# EAGLE design Curious-C (EAGLE 5.11)
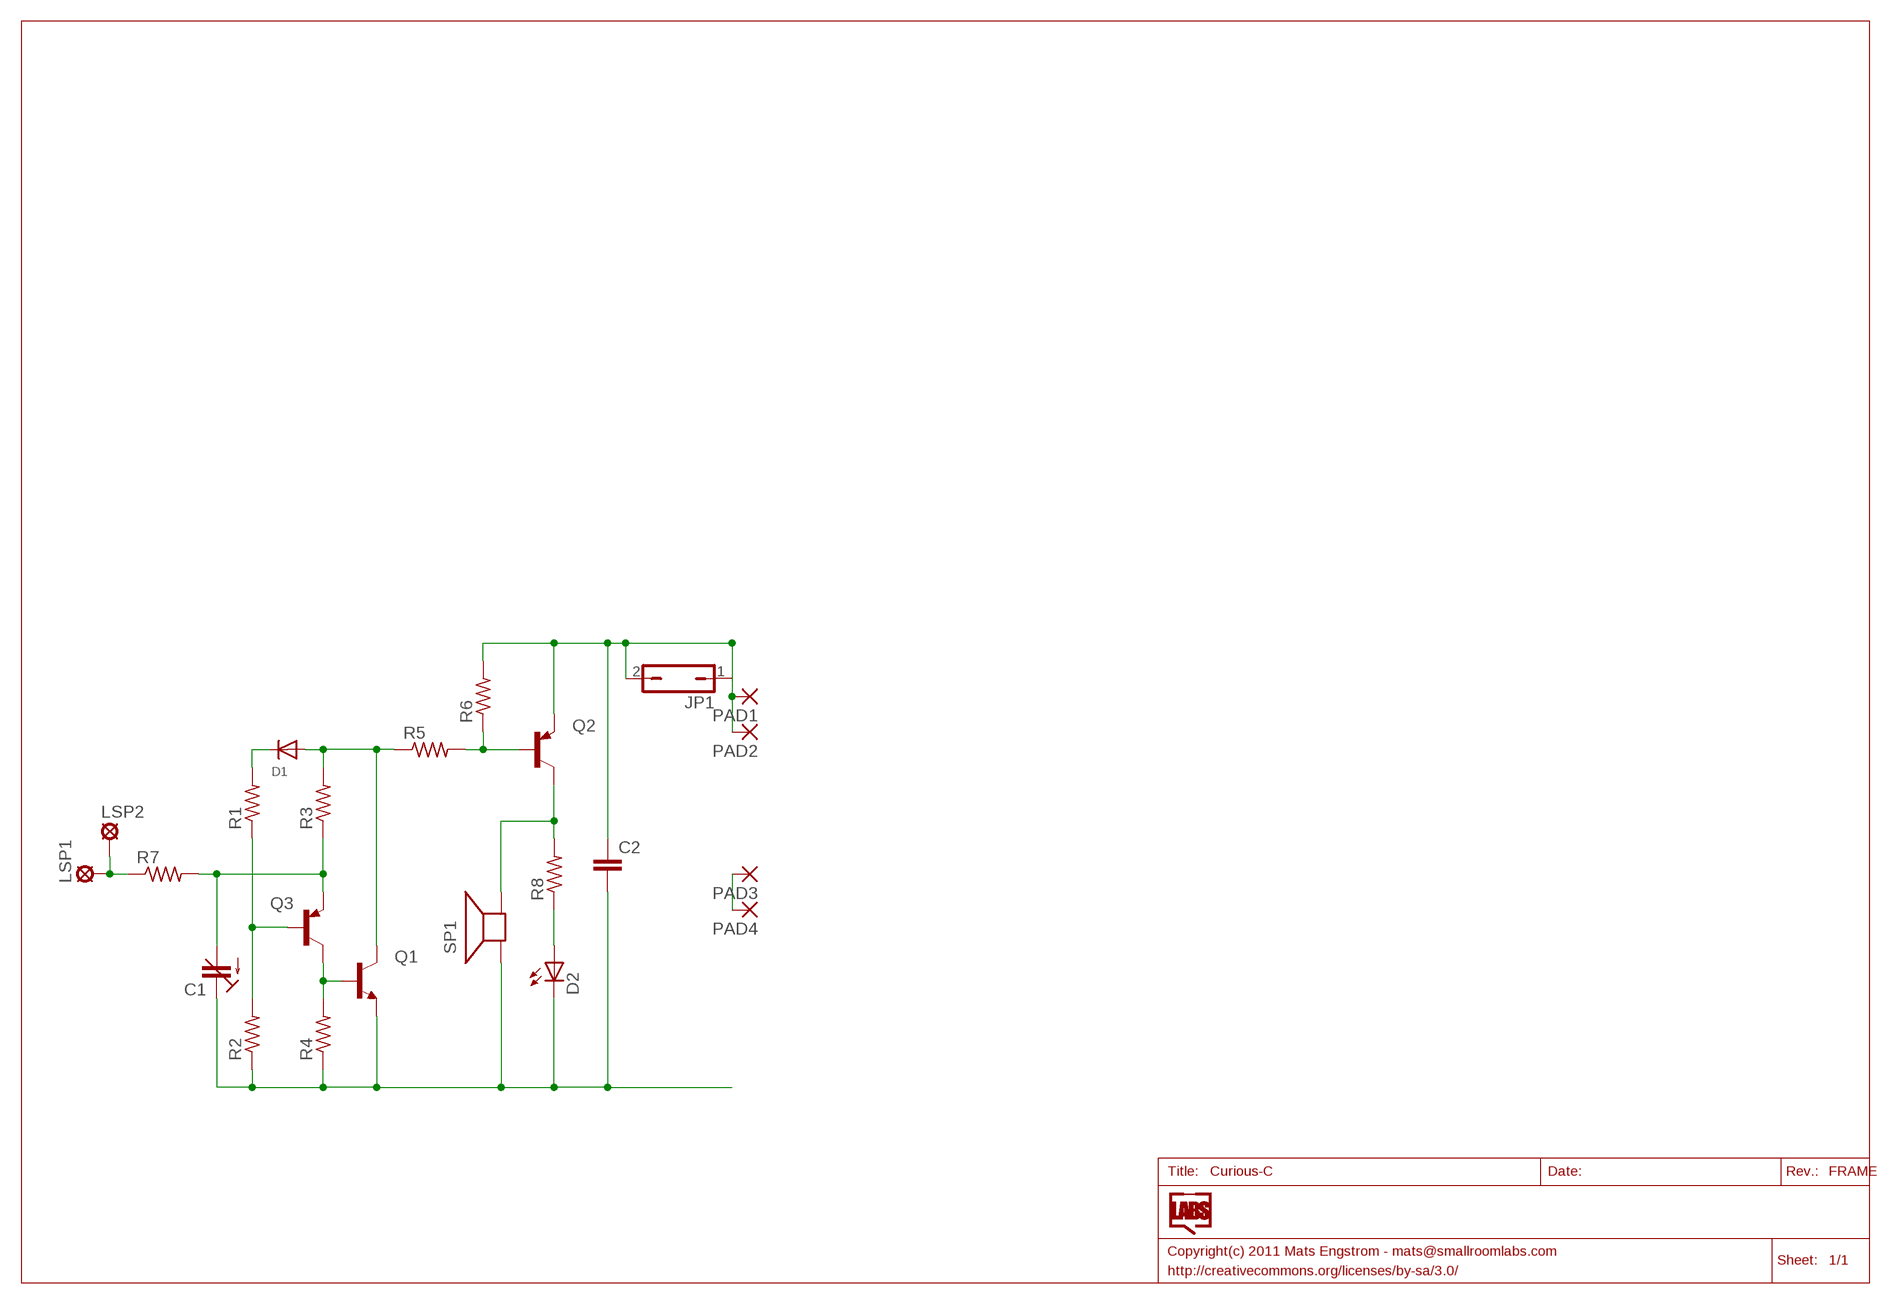
[diagram p0: schematic, sheet 1]

## Parts
C1  C-TRIMM808  [CTRIM808-BC]
C2  C-EU050-025X075  [C050-025X075]
D1  DIODEDO-1N4148  [DO-1N4148]
D2  LED3MM  [LED3MM]
JP1  JP1Q  [JP1]
LSP1  SE13  [SE13]
LSP2  SE13  [SE13]
PAD1  3,17/1,3  [3,17/1,3]
PAD2  3,17/1,3  [3,17/1,3]
PAD3  3,17/1,3  [3,17/1,3]
PAD4  3,17/1,3  [3,17/1,3]
Q1  2N5088  [TO92]
Q2  2N5087  [TO92]
Q3  2N5087  [TO92]
R1  R-US_0207/10  [0207/10]
R2  R-US_0207/10  [0207/10]
R3  R-US_0207/10  [0207/10]
R4  R-US_0207/10  [0207/10]
R5  R-US_0207/10  [0207/10]
R6  R-US_0207/10  [0207/10]
R7  R-US_0207/10  [0207/10]
R8  R-US_0207/10  [0207/10]
SP1  SPEAKER/PS12  [PS12]

## Nets
GND: C1.1(E) C2.2 D2.K(C) Q1.3(E) R2.1 R4.1 SP1.P$1(+)
MBATT: PAD3.1(P) PAD4.1(P)
N$1: Q1.2(B) Q3.1(C) R4.2
N$2: C1.2(A) Q3.3(E) R3.1 R7.2
N$5: D1.C R1.2
N$6: D1.A Q1.1(C) R3.2 R5.1
N$7: Q3.2(B) R1.1 R2.2
N$9: LSP1.MP LSP2.MP R7.1
N$11: D2.A R8.1
N$12: Q2.1(C) R8.2 SP1.P$2(-)
N$13: Q2.2(B) R5.2 R6.1
VCC: C2.1 JP1.1 JP1.2 PAD1.1(P) PAD2.1(P) Q2.3(E) R6.2

## Library data of the parts
C1 = resistor:C-TRIMM: Trimm capacitor
C2 = rcl:C-EU: CAPACITOR, European symbol
D1 = adafruit:DIODE: Diode SMADIODE - SMA Surface Mount Package 20V 1A Schottky Diode Digikey: 641-1014-6-ND DO-1N4148 - Through Hole Small Current Diode SOD-123 20V 1 A (.5mV Vf) Schottky Diode - Digikey: MBRX120TPMSCT-ND SOD-323 10V 570mA (.38mV Vf, 3ns) Schottky Diode - Digikey: ZLLS410CT-ND SOD-523 30V 30mA Schottky Diode (RB751S-40TE61) - Digikey: RB751S-40TE61CT-ND SOT23-R/W - SOT23 Package (R = Solder Paste/Reflow Ovens, W = Hand-Soldering) BAT54Film 40V 300mA - Digikey: 497-7162-1-ND
D2 = led:LED: LED OSRAM: - CHIPLED LG R971, LG N971, LY N971, LG Q971, LY Q971, LO R971, LY R971 LH N974, LH R974 LS Q976, LO Q976, LY Q976 LO Q996 - Hyper CHIPLED LW Q18S LB Q993, LB Q99A, LB R99A - SideLED LS A670, LO A670, LY A670, LG A670, LP A670 LB A673, LV A673, LT A673, LW A673 LH A674 LY A675 LS A676, LA A676, LO A676, LY A676, LW A676 LS A679, LY A679, LG A679 - Hyper Micro SIDELED® LS Y876, LA Y876, LO Y876, LY Y876 LT Y87S - SmartLED LW L88C, LW L88S LB L89C, LB L89S, LG L890 LS L89K, LO L89K, LY L89K LS L896, LA L896, LO L896, LY L896 - TOPLED LS T670, LO T670, LY T670, LG T670, LP T670 LSG T670, LSP T670, LSY T670, LOP T670, LYG T670 LG T671, LOG T671, LSG T671 LB T673, LV T673, LT T673, LW T673 LH T674 LS T676, LA T676, LO T676, LY T676, LB T676, LH T676, LSB T676, LW T676 LB T67C, LV T67C, LT T67C, LS T67K, LO T67K, LY T67K, LW E67C LS E67B, LA E67B, LO E67B, LY E67B, LB E67C, LV E67C, LT E67C LW T67C LS T679, LY T679, LG T679 LS T770, LO T770, LY T770, LG T770, LP T770 LB T773, LV T773, LT T773, LW T773 LH T774 LS E675, LA E675, LY E675, LS T675 LS T776, LA T776, LO T776, LY T776, LB T776 LHGB T686 LT T68C, LB T68C - Hyper Mini TOPLED® LB M676 - Mini TOPLED Santana® LG M470 LS M47K, LO M47K, LY M47K Source: http://www.osram.convergy.de LUXEON: - LUMILED® LXK2-PW12-R00, LXK2-PW12-S00, LXK2-PW14-U00, LXK2-PW14-V00 LXK2-PM12-R00, LXK2-PM12-S00, LXK2-PM14-U00 LXK2-PE12-Q00, LXK2-PE12-R00, LXK2-PE12-S00, LXK2-PE14-T00, LXK2-PE14-U00 LXK2-PB12-K00, LXK2-PB12-L00, LXK2-PB12-M00, LXK2-PB14-N00, LXK2-PB14-P00, LXK2-PB14-Q00 LXK2-PR12-L00, LXK2-PR12-M00, LXK2-PR14-Q00, LXK2-PR14-R00 LXK2-PD12-Q00, LXK2-PD12-R00, LXK2-PD12-S00 LXK2-PH12-R00, LXK2-PH12-S00 LXK2-PL12-P00, LXK2-PL12-Q00, LXK2-PL12-R00 Source: www.luxeon.com KINGBRIGHT: KA-3528ASYC Source: www.kingbright.com
JP1 = jumper:JP1Q: JUMPER
LSP1 LSP2 = solpad:SE13: SOLDER PAD E1542, drill 1,3mm, distributor Buerklin, 07F815
PAD1-PAD4 = wirepad:3,17/1,3: THROUGH-HOLE PAD
Q1 = transistor:2N5088: NPN TRANSISTOR
Q2 Q3 = transistor-pnp:2N5087: PNP Transistor
R1-R8 = resistor:R-US_: RESISTOR, American symbol
SP1 = adafruit:SPEAKER: SPEAKER Source: Buerklin Added PS12 (for part # PS1240 piezo) http://www.ladyada.net/library/pcb/eaglelibrary.html

## Net classes
0 default: width 0.406 mm, clearance 0.406 mm

## Board
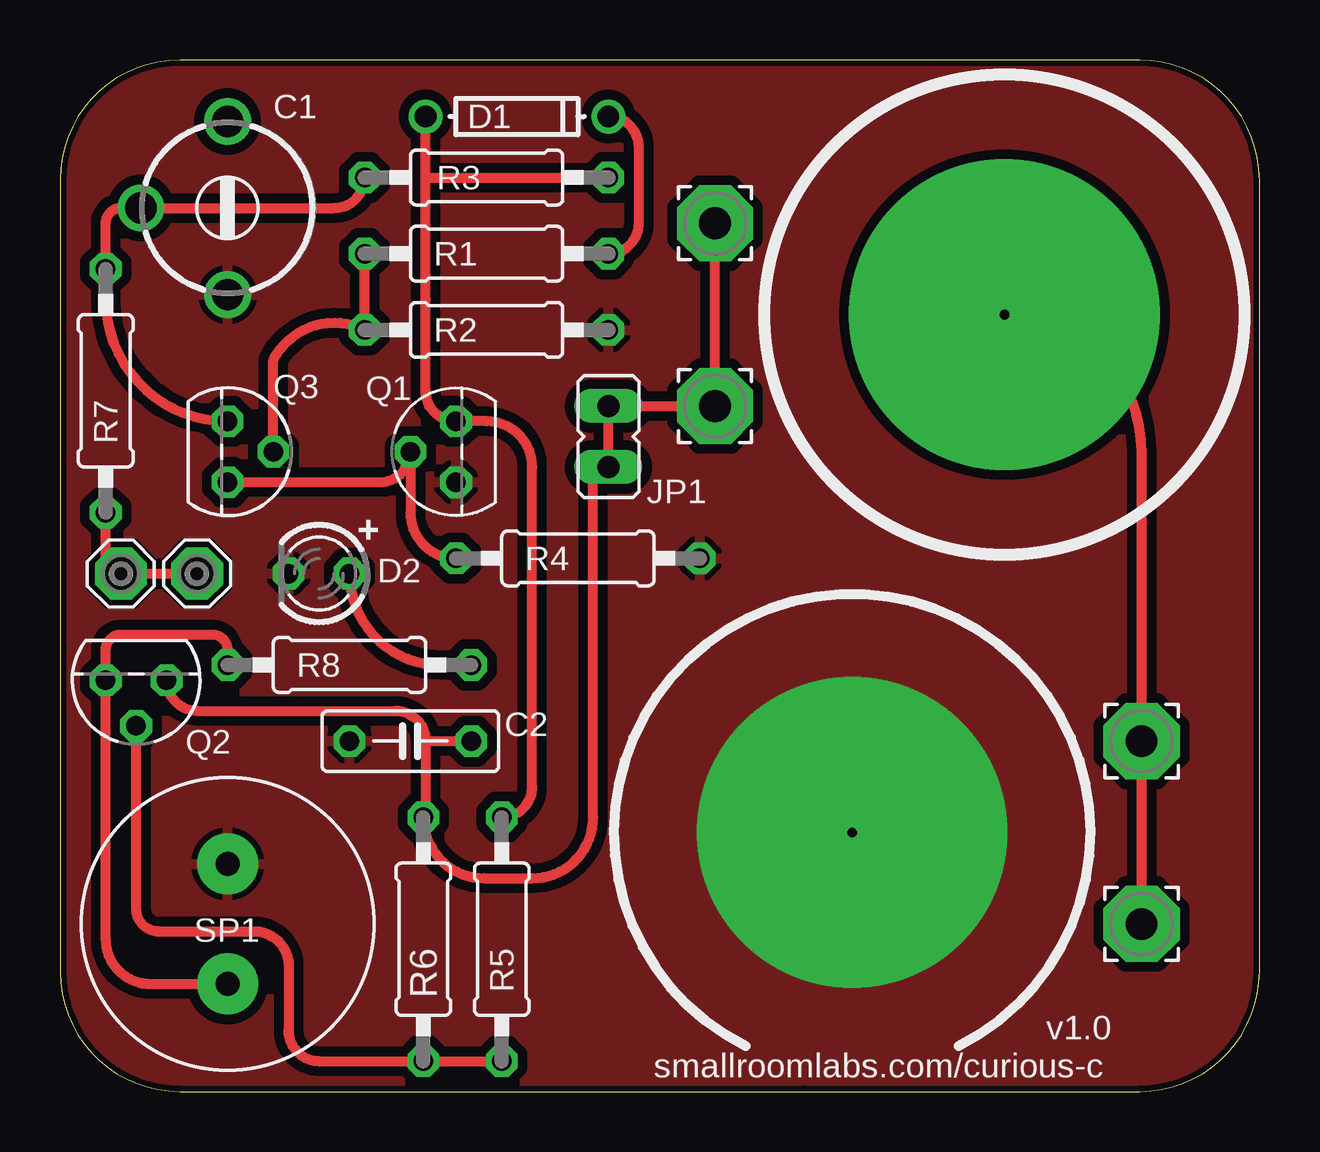
[diagram p1: board, top side]
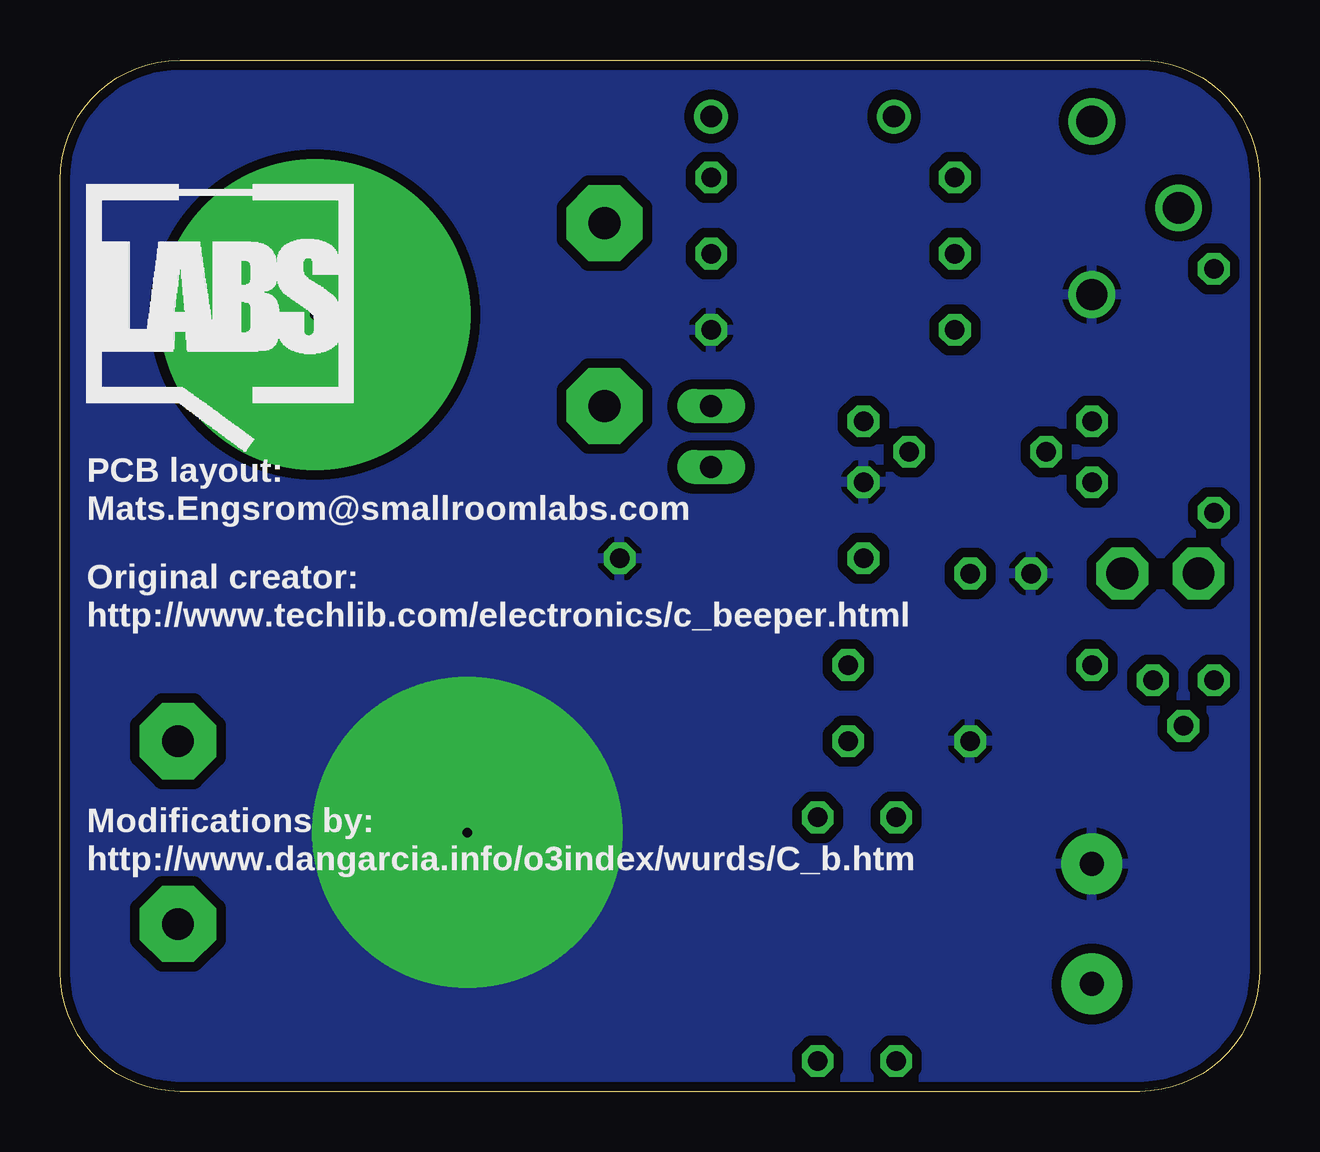
[diagram p2: board, bottom side, seen from below]

Size 50 x 43 mm. Coordinates in mm from the lower left corner, seen from the top.
Outline: 0,24 0,5 arc90 5,0 31,0 45,0 arc90 50,5 50,26 50,38 arc90 45,43 19.5,43 5,43 arc90 0,38 0,24
Copper layers (1*16): Top 0.035mm / dielectric 1.5mm / Bottom 0.035mm
Design rules "Fusion_eagle_rule_v1.1": minimum track width 6mil, minimum drill 12mil, track to track 6mil, track to pad 6mil, pad to pad 6mil, via to via 6mil, smd to smd 0mil, copper to edge 10mil, drill to drill 10mil, minimum pad ring 10mil, minimum via ring 6mil, stop-mask expansion 2mil, vias tented up to drill 100mil, thermal gap 10mil

### Footprints (pad centres in the part's own frame; a part is rotated, then mirrored left to right if it is on the bottom)
CTRIM808-BC = drill 1.3 round: 1 -3.607,0; 2 0,3.607; 3 3.607,0
C050-025X075 = drill 0.813 octagon: 1 -2.54,0; 2 2.54,0
DO-1N4148 = drill 0.9 round: A -3.81,0; C 3.81,0
LED3MM = drill 0.813 octagon: A -1.27,0; K 1.27,0
JP1 = drill 0.914 long: 1 0,-1.27; 2 0,1.27
SE13 = drill 1.321 pad 2.159 octagon: MP 0,0
3,17/1,3 = drill 1.321 pad 3.175 octagon: 1 0,0
TO92 = drill 0.813 octagon: 1 1.27,0; 2 0,1.905; 3 -1.27,0
0207/10 = drill 0.813 octagon: 1 -5.08,0; 2 5.08,0
PS12 = drill 1 pad 2.54 round: P$1 -2.5,0; P$2 2.5,0

### Placement (x,y rotation side)
C1  6.99,36.83 90 top
C2  14.61,14.61 180 top
D1  19.05,40.64 0 top
D2  10.79,21.59 180 top
JP1  22.86,27.3 180 top
LSP1  2.54,21.59 0 top
LSP2  5.71,21.59 0 top
PAD1  27.3,36.2 0 top
PAD2  27.3,28.57 0 top
PAD3  45.09,14.61 0 top
PAD4  45.09,6.99 0 top
Q1  16.51,26.67 90 top
Q2  3.17,17.14 180 top
Q3  6.99,26.67 270 top
R1  17.78,34.92 0 top
R2  17.78,31.75 180 top
R3  17.78,38.1 0 top
R4  21.59,22.23 180 top
R5  18.41,6.35 270 top
R6  15.14,6.35 90 top
R7  1.91,29.21 90 top
R8  12.06,17.78 180 top
SP1  6.99,6.99 270 top
U$2  [SRL-LOGO-SILK-10MM]  48.9,26.67 0 bottom
U$3  [SRL-LOGO-STOP-5MM]  20.32,1.91 0 top

### Tracks (layer width: path | path; a pad name or v marks a point on that pad's centre or on a via)
GND  (via drill 0.4 pad 12.95)
  other vias: 33.02,10.79
  pour Bottom (isolate 0.406): 0,22.86 0,38.18 arc-90 5,43.18 30.48,43.18 45.16,43.18 arc-90 50.16,38.18 50.16,20.95 50.16,5 arc-90 45.16,0 27.94,0 5,0 arc-90 0,5
  pour Top: 0,22.86 0,39.18 arc-90 4,43.18 27.94,43.18 46.16,43.18 arc-90 50.16,39.18 50.16,19.68 50.16,4 arc-90 46.16,0 24.77,0 4,0 arc-90 0,4
MBATT  (via drill 0.4 pad 12.95)
  Top 0.406: PAD4.1 PAD3.1 45.09,26.67 arc90 v39.37,32.38
N$1
  Top 0.406: Q3.1 8.89,25.4 | 8.89,25.4 10.16,25.4 | 8.89,25.4 13.34,25.4 arc90 Q1.2 14.61,24.13 arc90 R4.2
N$2
  Top 0.406: Q3.3 arc-90 1.91,33.02 R7.2 1.91,36.2 arc-90 2.54,36.83 C1.2 11.43,36.83 arc90 R3.1
N$5
  Top 0.406: R1.2 arc90 24.13,36.2 24.13,39.37 arc90 D1.C
N$6
  Top 0.406: R5.1 arc90 19.68,12.7 19.68,26.04 arc90 17.78,27.94 Q1.1 arc-90 15.24,29.21 15.24,33.02 15.24,38.1 | 15.24,38.1 D1.A | 15.24,38.1 R3.2
N$7
  Top 0.406: R1.1 R2.2 arc90 8.89,30.48 Q3.2
N$9
  Top 0.406: LSP2.MP LSP1.MP arc-90 1.91,22.23 R7.1
N$11
  Top 0.406: R8.1 15.88,17.78 arc-90 D2.A
N$12
  Top 0.406: SP1.P$2 3.77,4.49 arc-90 1.91,6.35 Q2.1 1.91,18.41 arc-90 2.54,19.05 6.35,19.05 arc-90 6.99,18.41 R8.2
N$13
  Top 0.406: R5.2 R6.1 10.79,1.27 arc-90 9.53,2.54 9.53,5.4 arc90 7.94,6.67 4.13,6.67 arc-90 3.17,7.62 Q2.2
VCC
  Top 0.406: Q2.3 arc90 5.71,15.88 13.97,15.88 arc-90 15.24,14.61 | 15.24,14.61 15.24,11.53 arc-90 R6.2 arc90 17.68,8.89 19.68,8.89 arc90 22.23,11.43 22.23,25.4 arc-90 JP1.2 JP1.1 PAD2.1 PAD1.1 | 15.24,14.61 C2.1

### Text on the board
tPlace: + | v1.0
bPlace: PCB layout: | Mats.Engsrom@smallroomlabs.com | Original creator: | http://www.techlib.com/electronics/c_beeper.html | Modifications by: | http://www.dangarcia.info/o3index/wurds/C_b.htm
tNames: smallroomlabs.com/curious-c